# EAGLE schematic Stepper_2_0 (EAGLE 8.3.2)
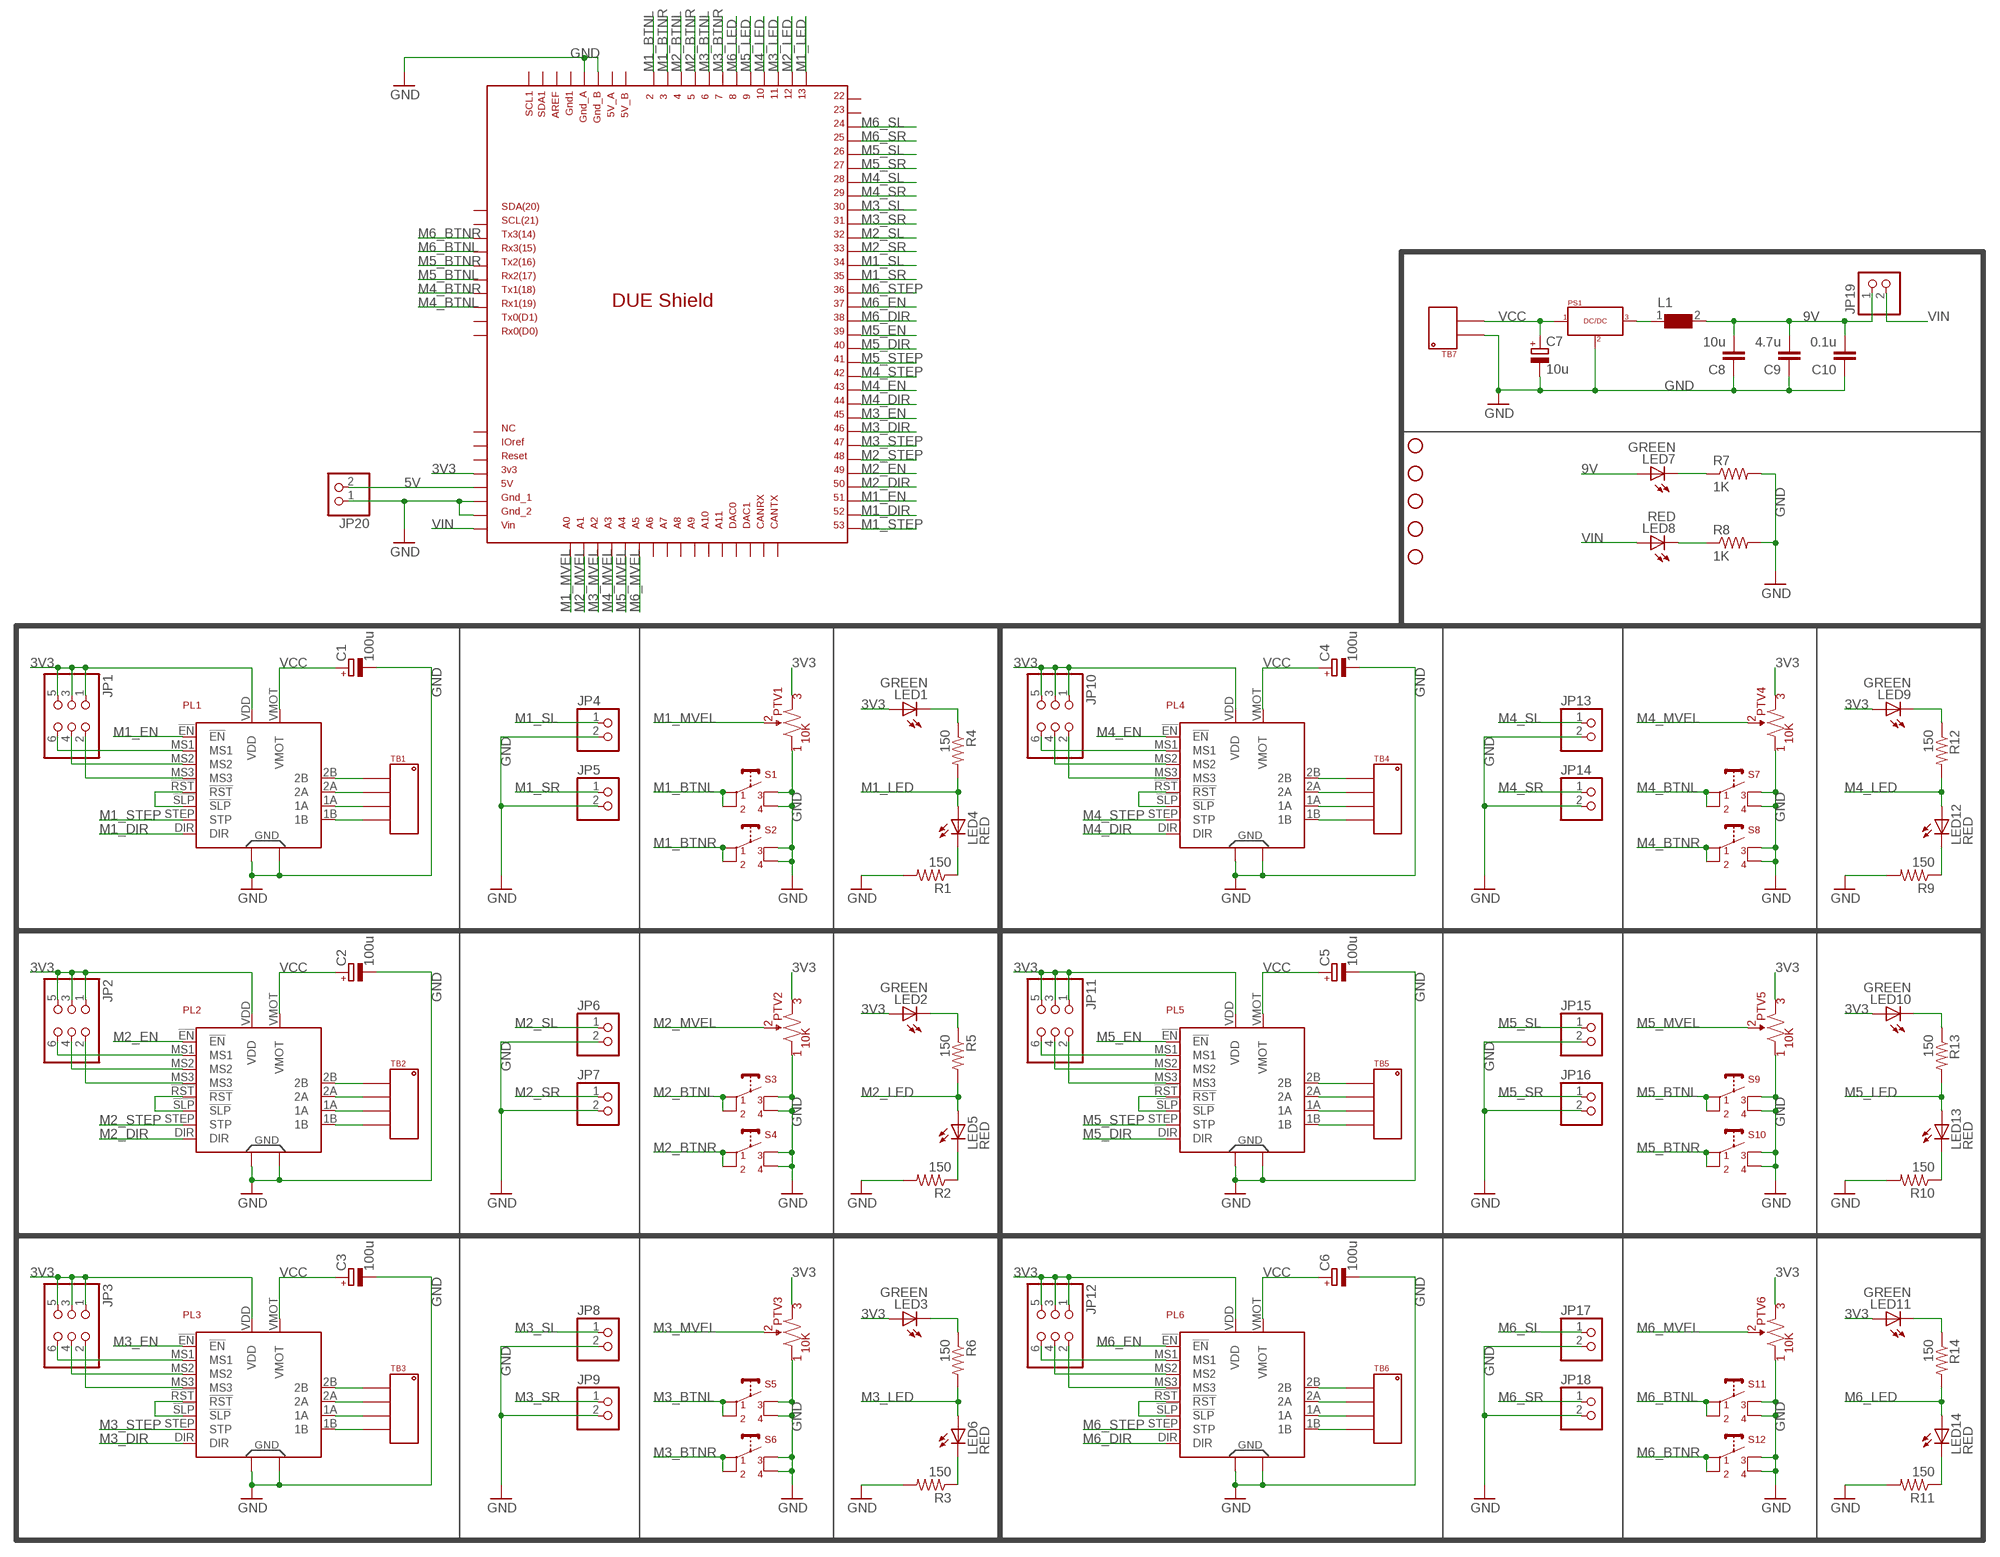
[diagram p0: schematic, sheet 1]

## Parts
C1  100u  CPOL-EUETR2  [ETR2]
C2  100u  CPOL-EUETR2  [ETR2]
C3  100u  CPOL-EUETR2  [ETR2]
C4  100u  CPOL-EUETR2  [ETR2]
C5  100u  CPOL-EUETR2  [ETR2]
C6  100u  CPOL-EUETR2  [ETR2]
C7  10u  CPOL-EUE2-4  [E2-4]
C8  10u  CAP1206  [1206]
C9  4.7u  CAP1206  [1206]
C10  0.1u  CAP1206  [1206]
DUE1  DUE(NOSPI)  [DUE(NOSPI)]
H1  STAND-OFF  [STAND-OFF]
H2  STAND-OFF  [STAND-OFF]
H3  STAND-OFF  [STAND-OFF]
H4  STAND-OFF  [STAND-OFF]
H5  STAND-OFF  [STAND-OFF]
JP1  PINHD-2X3  [2X03]
JP2  PINHD-2X3  [2X03]
JP3  PINHD-2X3  [2X03]
JP4  PINHD-1X2  [1X02]
JP5  PINHD-1X2  [1X02]
JP6  PINHD-1X2  [1X02]
JP7  PINHD-1X2  [1X02]
JP8  PINHD-1X2  [1X02]
JP9  PINHD-1X2  [1X02]
JP10  PINHD-2X3  [2X03]
JP11  PINHD-2X3  [2X03]
JP12  PINHD-2X3  [2X03]
JP13  PINHD-1X2  [1X02]
JP14  PINHD-1X2  [1X02]
JP15  PINHD-1X2  [1X02]
JP16  PINHD-1X2  [1X02]
JP17  PINHD-1X2  [1X02]
JP18  PINHD-1X2  [1X02]
JP19  PINHD-1X2  [1X02]
JP20  PINHD-1X2  [1X02]
L1  WE-CBF-742792118_1206  [1206]
LED1  GREEN  LEDSMT1206  [1206]
LED2  GREEN  LEDSMT1206  [1206]
LED3  GREEN  LEDSMT1206  [1206]
LED4  RED  LEDSMT1206  [1206]
LED5  RED  LEDSMT1206  [1206]
LED6  RED  LEDSMT1206  [1206]
LED7  GREEN  LEDSMT1206  [1206]
LED8  RED  LEDSMT1206  [1206]
LED9  GREEN  LEDSMT1206  [1206]
LED10  GREEN  LEDSMT1206  [1206]
LED11  GREEN  LEDSMT1206  [1206]
LED12  RED  LEDSMT1206  [1206]
LED13  RED  LEDSMT1206  [1206]
LED14  RED  LEDSMT1206  [1206]
PL1  A4988X  [MD09X]
PL2  A4988X  [MD09X]
PL3  A4988X  [MD09X]
PL4  A4988X  [MD09X]
PL5  A4988X  [MD09X]
PL6  A4988X  [MD09X]
PS1  VX78-500  [VX78-500]
PTV1  10K  PTV09A-4  [PTV09A-4]
PTV2  10K  PTV09A-4  [PTV09A-4]
PTV3  10K  PTV09A-4  [PTV09A-4]
PTV4  10K  PTV09A-4  [PTV09A-4]
PTV5  10K  PTV09A-4  [PTV09A-4]
PTV6  10K  PTV09A-4  [PTV09A-4]
R1  150  RESISTOR1206  [1206]
R2  150  RESISTOR1206  [1206]
R3  150  RESISTOR1206  [1206]
R4  150  RESISTOR1206  [1206]
R5  150  RESISTOR1206  [1206]
R6  150  RESISTOR1206  [1206]
R7  1K  RESISTOR1206  [1206]
R8  1K  RESISTOR1206  [1206]
R9  150  RESISTOR1206  [1206]
R10  150  RESISTOR1206  [1206]
R11  150  RESISTOR1206  [1206]
R12  150  RESISTOR1206  [1206]
R13  150  RESISTOR1206  [1206]
R14  150  RESISTOR1206  [1206]
S1  BTN_SPST_6MM  [BTN_SPST_6MM]
S2  BTN_SPST_6MM  [BTN_SPST_6MM]
S3  BTN_SPST_6MM  [BTN_SPST_6MM]
S4  BTN_SPST_6MM  [BTN_SPST_6MM]
S5  BTN_SPST_6MM  [BTN_SPST_6MM]
S6  BTN_SPST_6MM  [BTN_SPST_6MM]
S7  BTN_SPST_6MM  [BTN_SPST_6MM]
S8  BTN_SPST_6MM  [BTN_SPST_6MM]
S9  BTN_SPST_6MM  [BTN_SPST_6MM]
S10  BTN_SPST_6MM  [BTN_SPST_6MM]
S11  BTN_SPST_6MM  [BTN_SPST_6MM]
S12  BTN_SPST_6MM  [BTN_SPST_6MM]
TB1  TB_HEAD_3.5MM_01X04  [TB_HEAD_3.5MM_01X04]
TB2  TB_HEAD_3.5MM_01X04  [TB_HEAD_3.5MM_01X04]
TB3  TB_HEAD_3.5MM_01X04  [TB_HEAD_3.5MM_01X04]
TB4  TB_HEAD_3.5MM_01X04  [TB_HEAD_3.5MM_01X04]
TB5  TB_HEAD_3.5MM_01X04  [TB_HEAD_3.5MM_01X04]
TB6  TB_HEAD_3.5MM_01X04  [TB_HEAD_3.5MM_01X04]
TB7  TB_HEAD_3.5MM_01X02  [TB_HEAD_3.5MM_01X02]

## Nets
3V3: DUE1.3V3 JP1.1 JP1.3 JP1.5 JP2.1 JP2.3 JP2.5 JP3.1 JP3.3 JP3.5 JP10.1 JP10.3 JP10.5 JP11.1 JP11.3 JP11.5 JP12.1 JP12.3 JP12.5 LED1.A LED2.A LED3.A LED9.A LED10.A LED11.A PL1.VDD PL2.VDD PL3.VDD PL4.VDD PL5.VDD PL6.VDD PTV1.P$3 PTV2.P$3 PTV3.P$3 PTV4.P$3 PTV5.P$3 PTV6.P$3
5V: DUE1.5V JP20.2
9V: C8.2 C9.2 C10.2 JP19.1 L1.2 LED7.A
GND: C1.- C2.- C3.- C4.- C5.- C6.- C7.- C8.1 C9.1 C10.1 DUE1.GND_1 DUE1.GND_2 DUE1.GND_A DUE1.GND_B JP4.2 JP5.2 JP6.2 JP7.2 JP8.2 JP9.2 JP13.2 JP14.2 JP15.2 JP16.2 JP17.2 JP18.2 JP20.1 PL1.GND1 PL1.GND2 PL2.GND1 PL2.GND2 PL3.GND1 PL3.GND2 PL4.GND1 PL4.GND2 PL5.GND1 PL5.GND2 PL6.GND1 PL6.GND2 PS1.P$3 PTV1.P$1 PTV2.P$1 PTV3.P$1 PTV4.P$1 PTV5.P$1 PTV6.P$1 R1.2 R2.2 R3.2 R7.2 R8.2 R9.2 R10.2 R11.2 S1.P$3 S1.P$4 S2.P$3 S2.P$4 S3.P$3 S3.P$4 S4.P$3 S4.P$4 S5.P$3 S5.P$4 S6.P$3 S6.P$4 S7.P$3 S7.P$4 S8.P$3 S8.P$4 S9.P$3 S9.P$4 S10.P$3 S10.P$4 S11.P$3 S11.P$4 S12.P$3 S12.P$4 TB7.P$1
M1_BTNL: DUE1.2 S1.P$1 S1.P$2
M1_BTNR: DUE1.3 S2.P$1 S2.P$2
M1_DIR: DUE1.52 PL1.DIR
M1_EN: DUE1.51 PL1.!EN
M1_LED: DUE1.13 LED4.A R4.2
M1_MVEL: DUE1.A0 PTV1.P$2
M1_SL: DUE1.34 JP4.1
M1_SR: DUE1.35 JP5.1
M1_STEP: DUE1.53 PL1.STEP(STP)
M2_BTNL: DUE1.4 S3.P$1 S3.P$2
M2_BTNR: DUE1.5 S4.P$1 S4.P$2
M2_DIR: DUE1.50 PL2.DIR
M2_EN: DUE1.49 PL2.!EN
M2_LED: DUE1.12 LED5.A R5.2
M2_MVEL: DUE1.A1 PTV2.P$2
M2_SL: DUE1.32 JP6.1
M2_SR: DUE1.33 JP7.1
M2_STEP: DUE1.48 PL2.STEP(STP)
M3_BTNL: DUE1.6 S5.P$1 S5.P$2
M3_BTNR: DUE1.7 S6.P$1 S6.P$2
M3_DIR: DUE1.46 PL3.DIR
M3_EN: DUE1.45 PL3.!EN
M3_LED: DUE1.11 LED6.A R6.2
M3_MVEL: DUE1.A2 PTV3.P$2
M3_SL: DUE1.30 JP8.1
M3_SR: DUE1.31 JP9.1
M3_STEP: DUE1.47 PL3.STEP(STP)
M4_BTNL: DUE1.RX1 S7.P$1 S7.P$2
M4_BTNR: DUE1.TX1 S8.P$1 S8.P$2
M4_DIR: DUE1.44 PL4.DIR
M4_EN: DUE1.43 PL4.!EN
M4_LED: DUE1.10 LED12.A R12.2
M4_MVEL: DUE1.A3 PTV4.P$2
M4_SL: DUE1.28 JP13.1
M4_SR: DUE1.29 JP14.1
M4_STEP: DUE1.42 PL4.STEP(STP)
M5_BTNL: DUE1.RX2 S9.P$1 S9.P$2
M5_BTNR: DUE1.TX2 S10.P$1 S10.P$2
M5_DIR: DUE1.40 PL5.DIR
M5_EN: DUE1.39 PL5.!EN
M5_LED: DUE1.9 LED13.A R13.2
M5_MVEL: DUE1.A4 PTV5.P$2
M5_SL: DUE1.26 JP15.1
M5_SR: DUE1.27 JP16.1
M5_STEP: DUE1.41 PL5.STEP(STP)
M6_BTNL: DUE1.RX3 S11.P$1 S11.P$2
M6_BTNR: DUE1.TX3 S12.P$1 S12.P$2
M6_DIR: DUE1.38 PL6.DIR
M6_EN: DUE1.37 PL6.!EN
M6_LED: DUE1.8 LED14.A R14.2
M6_MVEL: DUE1.A5 PTV6.P$2
M6_SL: DUE1.24 JP17.1
M6_SR: DUE1.25 JP18.1
M6_STEP: DUE1.36 PL6.STEP(STP)
N$1: PL2.1B TB2.P$4
N$2: PL2.1A TB2.P$3
N$3: PL2.2A TB2.P$2
N$4: PL2.2B TB2.P$1
N$5: PL2.!RST PL2.!SLP
N$6: JP2.2 PL2.MS3
N$7: JP2.4 PL2.MS2
N$8: JP2.6 PL2.MS1
N$9: LED4.C R1.1
N$10: LED5.C R2.1
N$11: LED1.C R4.1
N$13: LED2.C R5.1
N$15: PL3.1B TB3.P$4
N$16: PL3.1A TB3.P$3
N$17: PL3.2A TB3.P$2
N$18: PL3.2B TB3.P$1
N$19: PL3.!RST PL3.!SLP
N$20: JP3.2 PL3.MS3
N$21: JP3.4 PL3.MS2
N$22: JP3.6 PL3.MS1
N$23: LED6.C R3.1
N$24: LED3.C R6.1
N$26: PL4.1B TB4.P$4
N$27: PL4.1A TB4.P$3
N$28: PL4.2A TB4.P$2
N$29: PL4.2B TB4.P$1
N$30: PL4.!RST PL4.!SLP
N$31: JP10.2 PL4.MS3
N$32: JP10.4 PL4.MS2
N$33: JP10.6 PL4.MS1
N$34: LED12.C R9.1
N$35: LED9.C R12.1
N$37: PL5.1B TB5.P$4
N$38: PL5.1A TB5.P$3
N$39: PL5.2A TB5.P$2
N$40: PL5.2B TB5.P$1
N$41: PL5.!RST PL5.!SLP
N$42: JP11.2 PL5.MS3
N$43: JP11.4 PL5.MS2
N$44: JP11.6 PL5.MS1
N$45: LED13.C R10.1
N$46: LED10.C R13.1
N$48: PL6.1B TB6.P$4
N$49: PL6.1A TB6.P$3
N$50: PL6.2A TB6.P$2
N$51: PL6.2B TB6.P$1
N$52: PL6.!RST PL6.!SLP
N$53: JP12.6 PL6.MS1
N$54: JP12.4 PL6.MS2
N$55: JP12.2 PL6.MS3
N$56: LED14.C R11.1
N$57: PL1.1B TB1.P$4
N$58: PL1.1A TB1.P$3
N$59: PL1.2A TB1.P$2
N$60: PL1.2B TB1.P$1
N$61: LED11.C R14.1
N$62: PL1.!RST PL1.!SLP
N$64: JP1.2 PL1.MS3
N$65: JP1.4 PL1.MS2
N$66: JP1.6 PL1.MS1
N$67: L1.1 PS1.P$2
N$68: LED7.C R7.1
N$71: LED8.C R8.1
VCC: C1.+ C2.+ C3.+ C4.+ C5.+ C6.+ C7.+ PL1.VMOT PL2.VMOT PL3.VMOT PL4.VMOT PL5.VMOT PL6.VMOT PS1.P$1 TB7.P$2
VIN: DUE1.VIN JP19.2 LED8.A
Unconnected: DUE1.5V_A DUE1.5V_B DUE1.22 DUE1.23 DUE1.A6 DUE1.A7 DUE1.A8 DUE1.A9 DUE1.A10 DUE1.A11 DUE1.AREF DUE1.CANRX DUE1.CANTX DUE1.DAC0 DUE1.DAC1 DUE1.GND1 DUE1.IOREF DUE1.NC DUE1.RESET DUE1.RX0 DUE1.SCL DUE1.SCL1 DUE1.SDA DUE1.SDA1 DUE1.TX0

## Library data of the parts
C1-C7 = rcl:CPOL-EU: POLARIZED CAPACITOR, European symbol
C8-C10 = SparkFun-Passives:CAP: Capacitor Standard 0603 ceramic capacitor, and 0.1" leaded capacitor.
DUE1 = JoshParts:DUE(NOSPI)
H1-H5 = SparkFun-Electromechanical:STAND-OFF: #4 Stand Off This is the mechanical footprint for a #4 phillips button head screw. Use the keepout ring to avoid running the screw head into surrounding components. SKU : PRT-00447
JP1-JP3 JP10-JP12 = pinhead:PINHD-2X3: PIN HEADER
JP4-JP9 JP13-JP20 = pinhead:PINHD-1X2: PIN HEADER
L1 = WE-CBF:WE-CBF: SMD EMI Suppression Ferrite Beads WE-CBF - Excellent anti-EMI properties - Low DC-restistance - Impedances till 3000 ohms - Rated current up to 6 A -- Reliable Ni-Sn electrodes -- Perfect as data lined filter and for uncoupling of distribution voltage; MPN: 742792118; OC_FARNELL: 1800374; OC_NEWARK: 78R5648; PACKAGE: IND-1206; SUPPLIER: Wuerth Elektronik
LED1-LED14 = adafruit:LED: LED OSRAM: - CHIPLED LG R971, LG N971, LY N971, LG Q971, LY Q971, LO R971, LY R971 LH N974, LH R974 LS Q976, LO Q976, LY Q976 LO Q996 - Hyper CHIPLED LW Q18S LB Q993, LB Q99A, LB R99A - SideLED LS A670, LO A670, LY A670, LG A670, LP A670 LB A673, LV A673, LT A673, LW A673 LH A674 LY A675 LS A676, LA A676, LO A676, LY A676, LW A676 LS A679, LY A679, LG A679 - Hyper Micro SIDELED® LS Y876, LA Y876, LO Y876, LY Y876 LT Y87S - SmartLED LW L88C, LW L88S LB L89C, LB L89S, LG L890 LS L89K, LO L89K, LY L89K LS L896, LA L896, LO L896, LY L896 - TOPLED LS T670, LO T670, LY T670, LG T670, LP T670 LSG T670, LSP T670, LSY T670, LOP T670, LYG T670 LG T671, LOG T671, LSG T671 LB T673, LV T673, LT T673, LW T673 LH T674 LS T676, LA T676, LO T676, LY T676, LB T676, LH T676, LSB T676, LW T676 LB T67C, LV T67C, LT T67C, LS T67K, LO T67K, LY T67K, LW E67C LS E67B, LA E67B, LO E67B, LY E67B, LB E67C, LV E67C, LT E67C LW T67C LS T679, LY T679, LG T679 LS T770, LO T770, LY T770, LG T770, LP T770 LB T773, LV T773, LT T773, LW T773 LH T774 LS E675, LA E675, LY E675, LS T675 LS T776, LA T776, LO T776, LY T776, LB T776 LHGB T686 LT T68C, LB T68C - Hyper Mini TOPLED® LB M676 - Mini TOPLED Santana® LG M470 LS M47K, LO M47K, LY M47K Source: http://www.osram.convergy.de/
PL1-PL6 = Steppers:A4988X
PS1 = Steppers:VX78-500
PTV1-PTV6 = Steppers:PTV09A-4
R1-R14 = SparkFun-Resistors:RESISTOR: Resistor Basic schematic elements and footprints for 0603, 1206, and PTH resistors.
S1-S12 = Steppers:BTN_SPST_6MM
TB1-TB6 = Steppers:TB_HEAD_3.5MM_01X04
TB7 = Steppers:TB_HEAD_3.5MM_01X02